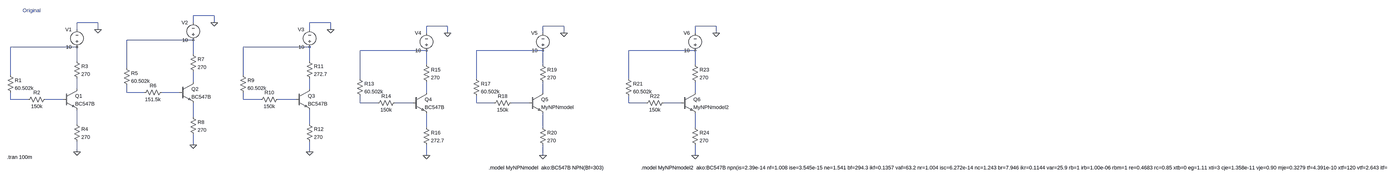
[diagram p0: schematic Lab3.1.asc, whole sheet]
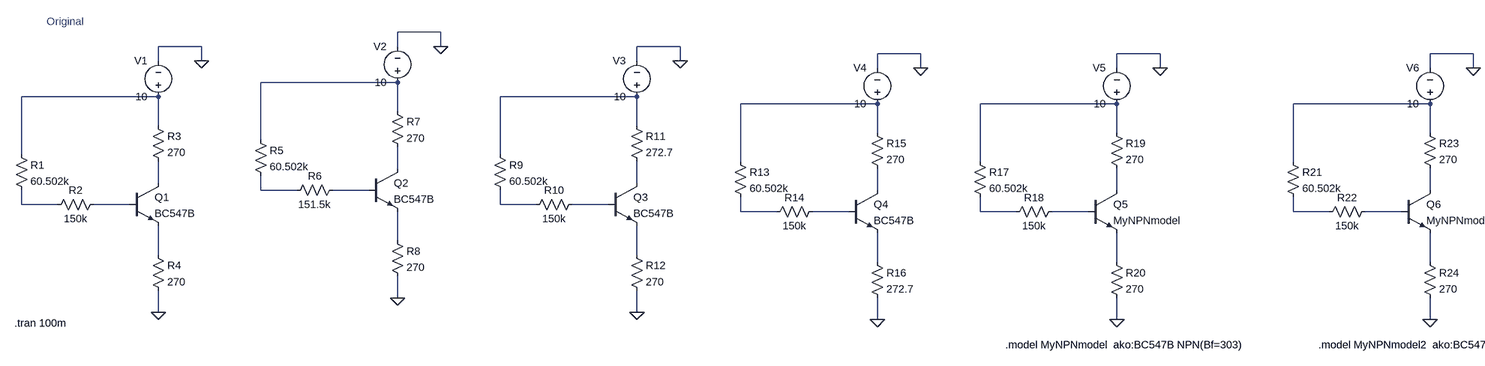
[diagram p1: schematic Lab3.1.asc, part, row 1 of 1, column 1 of 2]
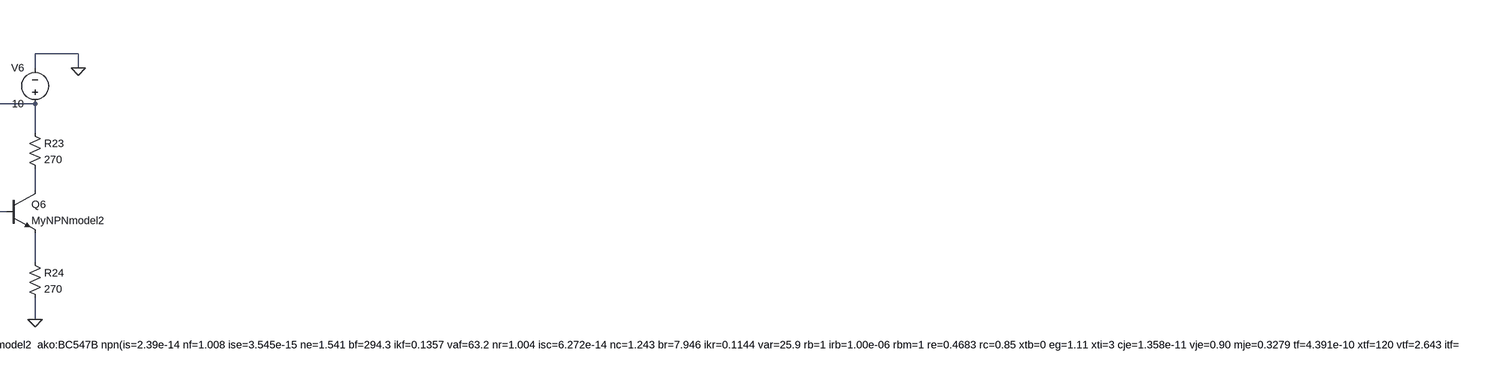
[diagram p2: schematic Lab3.1.asc, part, row 1 of 1, column 2 of 2]
Lab3.1.asc, the LTspice schematic file:
Version 4
SHEET 1 9180 680
WIRE 1312 -208 1216 -208
WIRE 512 -176 416 -176
WIRE 1216 -176 1216 -208
WIRE 1312 -176 1312 -208
WIRE 1984 -176 1888 -176
WIRE 2640 -160 2544 -160
WIRE 3184 -160 3088 -160
WIRE 3920 -160 3824 -160
WIRE 416 -144 416 -176
WIRE 512 -144 512 -176
WIRE 1888 -144 1888 -176
WIRE 1984 -144 1984 -176
WIRE 2544 -128 2544 -160
WIRE 2640 -128 2640 -160
WIRE 3088 -128 3088 -160
WIRE 3184 -128 3184 -160
WIRE 3824 -128 3824 -160
WIRE 3920 -128 3920 -160
WIRE 1216 -96 912 -96
WIRE 416 -64 112 -64
WIRE 1888 -64 1584 -64
WIRE 2544 -48 2240 -48
WIRE 3088 -48 2784 -48
WIRE 3824 -48 3520 -48
WIRE 1216 -32 1216 -96
WIRE 416 0 416 -64
WIRE 1888 0 1888 -64
WIRE 2544 16 2544 -48
WIRE 3088 16 3088 -48
WIRE 3824 16 3824 -48
WIRE 912 32 912 -96
WIRE 112 64 112 -64
WIRE 1584 64 1584 -64
WIRE 2240 80 2240 -48
WIRE 2784 80 2784 -48
WIRE 3520 80 3520 -48
WIRE 1216 96 1216 48
WIRE 416 128 416 80
WIRE 1888 128 1888 80
WIRE 912 144 912 112
WIRE 992 144 912 144
WIRE 1152 144 1072 144
WIRE 2544 144 2544 96
WIRE 3088 144 3088 96
WIRE 3824 144 3824 96
WIRE 112 176 112 144
WIRE 192 176 112 176
WIRE 352 176 272 176
WIRE 1584 176 1584 144
WIRE 1664 176 1584 176
WIRE 1824 176 1744 176
WIRE 2240 192 2240 160
WIRE 2320 192 2240 192
WIRE 2480 192 2400 192
WIRE 2784 192 2784 160
WIRE 2864 192 2784 192
WIRE 3024 192 2944 192
WIRE 3520 192 3520 160
WIRE 3600 192 3520 192
WIRE 3760 192 3680 192
WIRE 1216 256 1216 192
WIRE 416 288 416 224
WIRE 1888 288 1888 224
WIRE 2544 304 2544 240
WIRE 3088 304 3088 240
WIRE 3824 304 3824 240
WIRE 1216 384 1216 336
WIRE 416 416 416 368
WIRE 1888 416 1888 368
WIRE 2544 432 2544 384
WIRE 3088 432 3088 384
WIRE 3824 432 3824 384
FLAG 512 -144 0
FLAG 416 416 0
FLAG 1312 -176 0
FLAG 1216 384 0
FLAG 1984 -144 0
FLAG 1888 416 0
FLAG 2640 -128 0
FLAG 2544 432 0
FLAG 3184 -128 0
FLAG 3088 432 0
FLAG 3920 -128 0
FLAG 3824 432 0
SYMBOL res 96 48 R0
SYMATTR InstName R1
SYMATTR Value 60.502k
SYMBOL res 288 160 R90
WINDOW 0 0 56 VBottom 2
WINDOW 3 32 56 VTop 2
SYMATTR InstName R2
SYMATTR Value 150k
SYMBOL npn 352 128 R0
SYMATTR InstName Q1
SYMATTR Value BC547B
SYMBOL res 400 -16 R0
SYMATTR InstName R3
SYMATTR Value 270
SYMBOL res 400 272 R0
SYMATTR InstName R4
SYMATTR Value 270
SYMBOL voltage 416 -48 R180
WINDOW 0 24 96 Left 2
WINDOW 3 24 16 Left 2
WINDOW 123 0 0 Left 0
WINDOW 39 0 0 Left 0
SYMATTR InstName V1
SYMATTR Value 10
SYMBOL res 896 16 R0
SYMATTR InstName R5
SYMATTR Value 60.502k
SYMBOL res 1088 128 R90
WINDOW 0 0 56 VBottom 2
WINDOW 3 32 56 VTop 2
SYMATTR InstName R6
SYMATTR Value 151.5k
SYMBOL npn 1152 96 R0
SYMATTR InstName Q2
SYMATTR Value BC547B
SYMBOL res 1200 -48 R0
SYMATTR InstName R7
SYMATTR Value 270
SYMBOL res 1200 240 R0
SYMATTR InstName R8
SYMATTR Value 270
SYMBOL voltage 1216 -80 R180
WINDOW 0 24 96 Left 2
WINDOW 3 24 16 Left 2
WINDOW 123 0 0 Left 0
WINDOW 39 0 0 Left 0
SYMATTR InstName V2
SYMATTR Value 10
SYMBOL res 1568 48 R0
SYMATTR InstName R9
SYMATTR Value 60.502k
SYMBOL res 1760 160 R90
WINDOW 0 0 56 VBottom 2
WINDOW 3 32 56 VTop 2
SYMATTR InstName R10
SYMATTR Value 150k
SYMBOL npn 1824 128 R0
SYMATTR InstName Q3
SYMATTR Value BC547B
SYMBOL res 1872 -16 R0
SYMATTR InstName R11
SYMATTR Value 272.7
SYMBOL res 1872 272 R0
SYMATTR InstName R12
SYMATTR Value 270
SYMBOL voltage 1888 -48 R180
WINDOW 0 24 96 Left 2
WINDOW 3 24 16 Left 2
WINDOW 123 0 0 Left 0
WINDOW 39 0 0 Left 0
SYMATTR InstName V3
SYMATTR Value 10
SYMBOL res 2224 64 R0
SYMATTR InstName R13
SYMATTR Value 60.502k
SYMBOL res 2416 176 R90
WINDOW 0 0 56 VBottom 2
WINDOW 3 32 56 VTop 2
SYMATTR InstName R14
SYMATTR Value 150k
SYMBOL npn 2480 144 R0
SYMATTR InstName Q4
SYMATTR Value BC547B
SYMBOL res 2528 0 R0
SYMATTR InstName R15
SYMATTR Value 270
SYMBOL res 2528 288 R0
SYMATTR InstName R16
SYMATTR Value 272.7
SYMBOL voltage 2544 -32 R180
WINDOW 0 24 96 Left 2
WINDOW 3 24 16 Left 2
WINDOW 123 0 0 Left 0
WINDOW 39 0 0 Left 0
SYMATTR InstName V4
SYMATTR Value 10
SYMBOL res 2768 64 R0
SYMATTR InstName R17
SYMATTR Value 60.502k
SYMBOL res 2960 176 R90
WINDOW 0 0 56 VBottom 2
WINDOW 3 32 56 VTop 2
SYMATTR InstName R18
SYMATTR Value 150k
SYMBOL npn 3024 144 R0
SYMATTR InstName Q5
SYMATTR Value MyNPNmodel
SYMBOL res 3072 0 R0
SYMATTR InstName R19
SYMATTR Value 270
SYMBOL res 3072 288 R0
SYMATTR InstName R20
SYMATTR Value 270
SYMBOL voltage 3088 -32 R180
WINDOW 0 24 96 Left 2
WINDOW 3 24 16 Left 2
WINDOW 123 0 0 Left 0
WINDOW 39 0 0 Left 0
SYMATTR InstName V5
SYMATTR Value 10
SYMBOL res 3504 64 R0
SYMATTR InstName R21
SYMATTR Value 60.502k
SYMBOL res 3696 176 R90
WINDOW 0 0 56 VBottom 2
WINDOW 3 32 56 VTop 2
SYMATTR InstName R22
SYMATTR Value 150k
SYMBOL npn 3760 144 R0
SYMATTR InstName Q6
SYMATTR Value MyNPNmodel2
SYMBOL res 3808 0 R0
SYMATTR InstName R23
SYMATTR Value 270
SYMBOL res 3808 288 R0
SYMATTR InstName R24
SYMATTR Value 270
SYMBOL voltage 3824 -32 R180
WINDOW 0 24 96 Left 2
WINDOW 3 24 16 Left 2
WINDOW 123 0 0 Left 0
WINDOW 39 0 0 Left 0
SYMATTR InstName V6
SYMATTR Value 10
TEXT 96 440 Left 2 !.tran 100m
TEXT 168 -232 Left 2 ;Original
TEXT 2840 488 Left 2 !.model MyNPNmodel  ako:BC547B NPN(Bf=303)
TEXT 3576 488 Left 2 !.model MyNPNmodel2  ako:BC547B npn(is=2.39e-14 nf=1.008 ise=3.545e-15 ne=1.541 bf=294.3 ikf=0.1357 vaf=63.2 nr=1.004 isc=6.272e-14 nc=1.243 br=7.946 ikr=0.1144 var=25.9 rb=1 irb=1.00e-06 rbm=1 re=0.4683 rc=0.85 xtb=0 eg=1.11 xti=3 cje=1.358e-11 vje=0.90 mje=0.3279 tf=4.391e-10 xtf=120 vtf=2.643 itf=0.7495 ptf=0 cjc=3.728e-12 vjc=0.3997 mjc=0.2955 xcjc=0.6193 tr=1.00e-32 cjs=0 vjs=0.75 mjs=0.333 fc=0.9579 vceo=45 icrating=100m mfg=nxp)

The netlist it stands for:
* Lab3.1.asc
R1 N002 N015 60.502k
R2 N016 N015 150k
Q1 N008 N016 N026 0 BC547B
R3 N002 N008 270
R4 N026 0 270
V1 N002 0 10
R5 N001 N010 60.502k
R6 N011 N010 151.5k
Q2 N007 N011 N025 0 BC547B
R7 N001 N007 270
R8 N025 0 270
V2 N001 0 10
R9 N003 N017 60.502k
R10 N018 N017 150k
Q3 N009 N018 N027 0 BC547B
R11 N003 N009 272.7
R12 N027 0 270
V3 N003 0 10
R13 N004 N019 60.502k
R14 N020 N019 150k
Q4 N012 N020 N028 0 BC547B
R15 N004 N012 270
R16 N028 0 272.7
V4 N004 0 10
R17 N005 N021 60.502k
R18 N022 N021 150k
Q5 N013 N022 N029 0 MyNPNmodel
R19 N005 N013 270
R20 N029 0 270
V5 N005 0 10
R21 N006 N023 60.502k
R22 N024 N023 150k
Q6 N014 N024 N030 0 MyNPNmodel2
R23 N006 N014 270
R24 N030 0 270
V6 N006 0 10
.model NPN NPN
.model PNP PNP
.lib standard.bjt
.tran 100m
* Original
.model MyNPNmodel  ako:BC547B NPN(Bf=303)
.model MyNPNmodel2  ako:BC547B npn(is=2.39e-14 nf=1.008 ise=3.545e-15 ne=1.541 bf=294.3 ikf=0.1357 vaf=63.2 nr=1.004 isc=6.272e-14 nc=1.243 br=7.946 ikr=0.1144 var=25.9 rb=1 irb=1.00e-06 rbm=1 re=0.4683 rc=0.85 xtb=0 eg=1.11 xti=3 cje=1.358e-11 vje=0.90 mje=0.3279 tf=4.391e-10 xtf=120 vtf=2.643 itf=0.7495 ptf=0 cjc=3.728e-12 vjc=0.3997 mjc=0.2955 xcjc=0.6193 tr=1.00e-32 cjs=0 vjs=0.75 mjs=0.333 fc=0.9579 vceo=45 icrating=100m mfg=nxp)
.backanno
.end